# EAGLE schematic 16X2 LCD _pi (EAGLE 7.3.0)
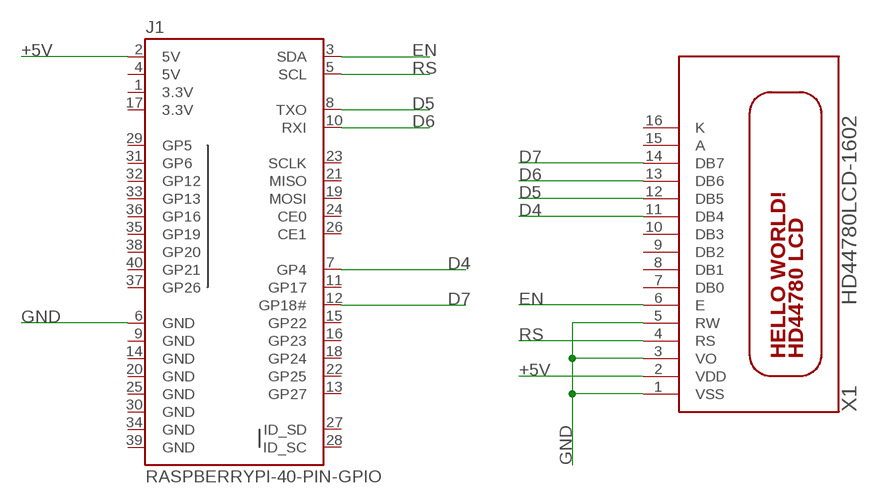
[diagram p0: schematic, sheet 1]

## Parts
J1  RASPBERRYPI-40-PIN-GPIO  [2X20-SHROUDED]
X1  HD44780LCD-1602  [LCD1602]

## Nets
+5V: J1.2(5V) X1.2(VDD)
D4: J1.7(GP4) X1.11(DB4)
D5: J1.8(TXO) X1.12(DB5)
D6: J1.10(RXI) X1.13(DB6)
D7: J1.12(GP18#) X1.14(DB7)
EN: J1.3(SDA) X1.6(E)
GND: J1.6(GND) X1.1(VSS) X1.3(VO) X1.5(RW)
RS: J1.5(SCL) X1.4(RS)
Unconnected: J1.11(GP17) J1.13(GP27) J1.15(GP22) J1.16(GP23) J1.18(GP24) J1.19(MOSI) J1.21(MISO) J1.22(GP25) J1.23(SCLK) J1.24(CE0) J1.26(CE1) J1.27(ID_SD) J1.28(ID_SC) J1.29(GP5) J1.31(GP6) J1.32(GP12) J1.33(GP13) J1.35(GP19) J1.36(GP16) J1.37(GP26) J1.38(GP20) J1.40(GP21) X1.7(DB0) X1.8(DB1) X1.9(DB2) X1.10(DB3) X1.15(A) X1.16(K)

## Power pins joined to a net without a drawn wire
3.3V: J1.1(3.3V) J1.17(3.3V)
5V: J1.4(5V)
GND: J1.9(GND) J1.14(GND) J1.20(GND) J1.25(GND) J1.30(GND) J1.34(GND) J1.39(GND)

## Library data of the parts
J1 = SparkFun-Boards:RASPBERRYPI-40-PIN-GPIO: Second Generation Raspberry Pi GPIO Header 2x20 pin connector, as found on B, B+, A+ models.
X1 = adafruit:HD44780LCD: HD44780 LCD Standard character type LCDs, available in sizes from 8x1 to 40x4!